# Altium schematic sheet Antenna.SchDoc
size A; SheetNumber: 2; SheetTotal: 2
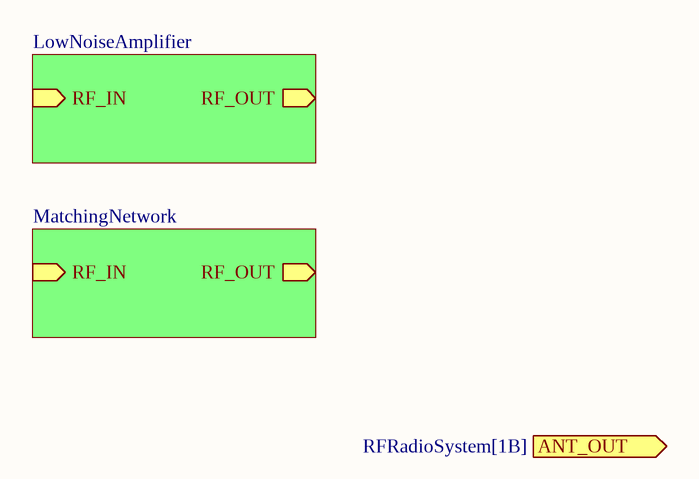
[diagram p0: Antenna.SchDoc]

## Sub-sheets
LowNoiseAmplifier = File Name: RF_OUT (out), RF_IN (in)
MatchingNetwork = File Name: RF_IN (in), RF_OUT (out)

## Ports
ANT_OUT (out, see RFRadioSystem[1B])